# EAGLE schematic rollo_steuerung_MEGA8_CAN (EAGLE 5.06)
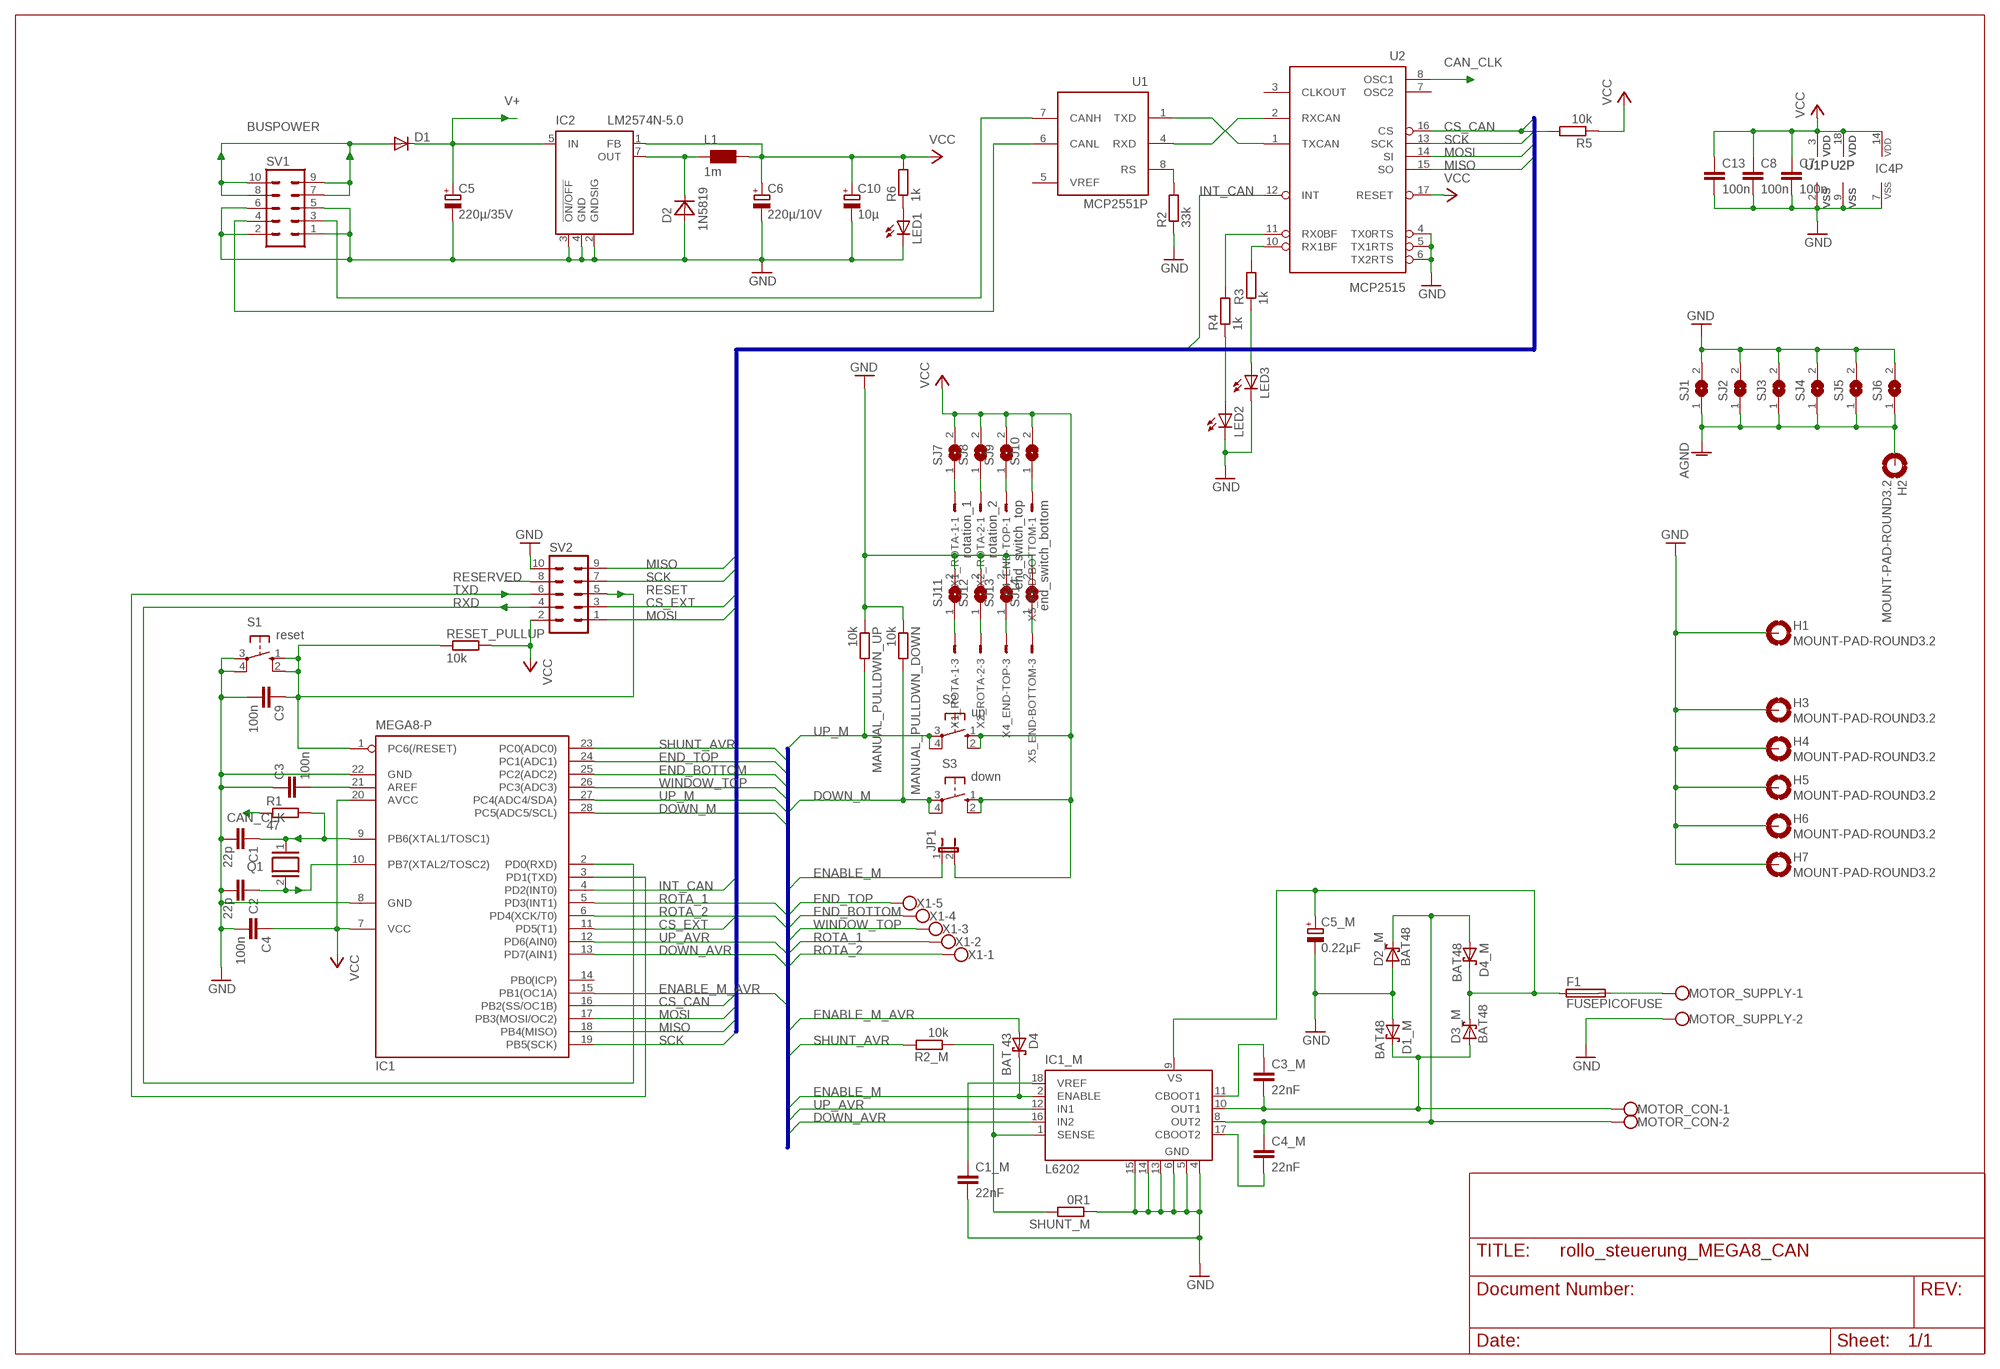
[diagram p0: schematic, sheet 1]

## Parts
C1  22p  C-EU025-024X044  [C025-024X044]
C1_M  22nF  C-EU025-024X044  [C025-024X044]
C2  22p  C-EU025-024X044  [C025-024X044]
C3  100n  C-EU025-024X044  [C025-024X044]
C3_M  22nF  C-EU025-024X044  [C025-024X044]
C4  100n  C-EU025-024X044  [C025-024X044]
C4_M  22nF  C-EU025-024X044  [C025-024X044]
C5  220µ/35V  CPOL-EUE3.5-8  [E3,5-8]
C5_M  0.22µF  CPOL-EUE2.5-5  [E2,5-5]
C6  220µ/10V  CPOL-EUE3.5-8  [E3,5-8]
C7  100n  C-EU025-024X044  [C025-024X044]
C8  100n  C-EU025-024X044  [C025-024X044]
C9  100n  C-EU025-024X044  [C025-024X044]
C10  10µ  CPOL-EUE2.5-5  [E2,5-5]
C13  100n  C-EU025-024X044  [C025-024X044]
D1  DIODE-MELF-MLL41  [MELF-MLL41]
D1_M  BAT48  BAT42  [DO35-10]
D2  1N5819  DIODE  [DO41-7]
D2_M  BAT48  BAT42  [DO35-10]
D3_M  BAT48  BAT42  [DO35-10]
D4  BAT 43  BAT42  [DO35-10]
D4_M  BAT48  BAT42  [DO35-10]
F1  FUSEPICOFUSE  [PICOFUSE]
H1  MOUNT-PAD-ROUND3.2  [3,2-PAD]
H2  MOUNT-PAD-ROUND3.2  [3,2-PAD]
H3  MOUNT-PAD-ROUND3.2  [3,2-PAD]
H4  MOUNT-PAD-ROUND3.2  [3,2-PAD]
H5  MOUNT-PAD-ROUND3.2  [3,2-PAD]
H6  MOUNT-PAD-ROUND3.2  [3,2-PAD]
H7  MOUNT-PAD-ROUND3.2  [3,2-PAD]
IC1  MEGA8-P  [DIL28-3]
IC1_M  L6202  [DIL18]
IC2  LM2574N-5.0  LM2574N-3.3  [DIL08]
IC4  4093N  [DIL14]
JP1  JP1E  [JP1]
L1  1m  L  [FASTRON-09P]
LED1  LED3MM  [LED3MM]
LED2  LED3MM  [LED3MM]
LED3  LED3MM  [LED3MM]
MANUAL_PULLDWN_DOWN  10k  R-EU_0204/7  [0204/7]
MANUAL_PULLDWN_UP  10k  R-EU_0204/7  [0204/7]
MOTOR_CON  W237-102  [W237-102]
MOTOR_SUPPLY  W237-102  [W237-102]
Q1  XTAL/S  [QS]
R1  47  R-EU_0204/7  [0204/7]
R2  33k  R-EU_0204/7  [0204/7]
R2_M  10k  R-EU_0204/7  [0204/7]
R3  1k  R-EU_0204/7  [0204/7]
R4  1k  R-EU_0204/7  [0204/7]
R5  10k  R-EU_0204/7  [0204/7]
R6  1k  R-EU_0204/7  [0204/7]
RESET_PULLUP  10k  R-EU_0204/7  [0204/7]
S1  reset  10-XX  [B3F-10XX]
S2  up  10-XX  [B3F-10XX]
S3  down  10-XX  [B3F-10XX]
SHUNT_M  0R1  R-EU_0204/7  [0204/7]
SJ1  SJW  [SJW]
SJ2  SJW  [SJW]
SJ3  SJW  [SJW]
SJ4  SJW  [SJW]
SJ5  SJW  [SJW]
SJ6  SJW  [SJW]
SJ7  SJW  [SJW]
SJ8  SJW  [SJW]
SJ9  SJW  [SJW]
SJ10  SJW  [SJW]
SJ11  SJW  [SJW]
SJ12  SJW  [SJW]
SJ13  SJW  [SJW]
SJ14  SJW  [SJW]
SV1  ML10L  [ML10L]
SV2  ML10  [ML10]
U1  MCP2551P  [DIL8]
U2  MCP2515  MCP2510P  [DIL18]
X1  W237-05P  [W237-5P]
X1_ROTA-1  rotation_1  22-23-2031  [22-23-2031]
X2_ROTA-2  rotation_2  22-23-2031  [22-23-2031]
X4_END-TOP  end_switch_top  22-23-2031  [22-23-2031]
X5_END-BOTTOM  end_switch_bottom  22-23-2031  [22-23-2031]

## Nets
AGND: H2.B3,2(MOUNT) SJ1.1 SJ2.1 SJ3.1 SJ4.1 SJ5.1 SJ6.1
BUSPOWER: D1.A SV1.7 SV1.8 SV1.9 SV1.10
CAN_CLK: R1.1 U2.8(OSC1)
CANH: SV1.3 U1.7(CANH)
CANL: SV1.4 U1.6(CANL)
CS_CAN: IC1.16(PB2(SS/OC1B)) R5.2 U2.16(CS)
CS_EXT: IC1.11(PD5(T1)) SV2.3
DOWN_AVR: IC1.13(PD7(AIN1)) IC1_M.16(IN2)
DOWN_M: IC1.28(PC5(ADC5/SCL)) MANUAL_PULLDWN_DOWN.2 S3.3(P) S3.4(P1)
ENABLE_M: D4.C IC1_M.2(ENABLE) JP1.1
ENABLE_M_AVR: D4.A IC1.15(PB1(OC1A))
END_BOTTOM: IC1.25(PC2(ADC2)) X1.4
END_TOP: IC1.24(PC1(ADC1)) X1.5
GND: C1.2 C1_M.2 C2.2 C3.1 C4.2 C5.- C5_M.- C6.- C7.2 C8.2 C9.2 C10.- C13.2 D1_M.A D2.A D2_M.A H1.B3,2(MOUNT) H3.B3,2(MOUNT) H4.B3,2(MOUNT) H5.B3,2(MOUNT) H6.B3,2(MOUNT) H7.B3,2(MOUNT) IC1.8(GND) IC1.22(GND) IC1_M.4(GND) IC1_M.5(GND) IC1_M.6(GND) IC1_M.13(GND) IC1_M.14(GND) IC1_M.15(GND) IC2.2(GNDSIG) IC2.3(!ON/OFF) IC2.4(GND) IC4.7(P:VSS) LED1.K(C) LED2.K(C) LED3.K(C) MANUAL_PULLDWN_DOWN.1 MANUAL_PULLDWN_UP.1 MOTOR_SUPPLY.2 R2.1 S1.3(P) S1.4(P1) SHUNT_M.1 SJ1.2 SJ2.2 SJ3.2 SJ4.2 SJ5.2 SJ6.2 SJ11.2 SJ12.2 SJ13.2 SJ14.2 SV1.1 SV1.2 SV1.5 SV1.6 SV2.10 U1.2(VSS) U2.4(TX0RTS) U2.5(TX1RTS) U2.6(TX2RTS) U2.9(VSS)
INT_CAN: IC1.4(PD2(INT0)) U2.12(INT)
MISO: IC1.18(PB4(MISO)) SV2.9 U2.15(SO)
MOSI: IC1.17(PB3(MOSI/OC2)) SV2.1 U2.14(SI)
MOTOR_OUT1: C3_M.2 D1_M.C D3_M.A IC1_M.10(OUT1) MOTOR_CON.1
MOTOR_OUT2: C4_M.1 D2_M.C D4_M.A IC1_M.8(OUT2) MOTOR_CON.2
MOTOR_VSS: C5_M.+ D3_M.C D4_M.C F1.1 IC1_M.9(VS)
N$5: R2.2 U1.8(RS)
N$7: R3.2 U2.10(RX1BF)
N$8: SJ11.1 X1_ROTA-1.3
N$9: C4_M.2 IC1_M.17(CBOOT2)
N$10: SJ12.1 X2_ROTA-2.3
N$13: C3_M.1 IC1_M.11(CBOOT1)
N$15: D2.C IC2.7(OUT) L1.1
N$16: SJ13.1 X4_END-TOP.3
N$18: SJ14.1 X5_END-BOTTOM.3
N$19: C1_M.1 IC1_M.18(VREF)
N$22: SJ10.1 X5_END-BOTTOM.1
N$23: SJ9.1 X4_END-TOP.1
N$24: SJ8.1 X2_ROTA-2.1
N$25: SJ7.1 X1_ROTA-1.1
N$26: F1.2 MOTOR_SUPPLY.1
N$27: LED2.A R4.1
N$28: LED3.A R3.1
N$30: C3.2 IC1.21(AREF)
N$41: LED1.A R6.1
N$44: R4.2 U2.11(RX0BF)
RESERVED: SV2.8
RESET: C9.1 IC1.1(PC6(/RESET)) RESET_PULLUP.1 S1.1(S) S1.2(S1) SV2.5
ROTA_1: IC1.5(PD3(INT1)) X1.2
ROTA_2: IC1.6(PD4(XCK/T0)) X1.1
RXCAN: U1.4(RXD) U2.2(RXCAN)
RXD: IC1.2(PD0(RXD)) SV2.4
SCK: IC1.19(PB5(SCK)) SV2.7 U2.13(SCK)
SHUNT: IC1_M.1(SENSE) R2_M.1 SHUNT_M.2
SHUNT_AVR: IC1.23(PC0(ADC0)) R2_M.2
TXCAN: U1.1(TXD) U2.1(TXCAN)
TXD: IC1.3(PD1(TXD)) SV2.6
UP_AVR: IC1.12(PD6(AIN0)) IC1_M.12(IN1)
UP_M: IC1.27(PC4(ADC4/SDA)) MANUAL_PULLDWN_UP.2 S2.3(P) S2.4(P1)
V+: C5.+ D1.C IC2.5(IN)
VCC: C4.1 C6.+ C7.1 C8.1 C10.+ C13.1 IC1.7(VCC) IC1.20(AVCC) IC2.1(FB) IC4.14(P:VDD) JP1.2 L1.2 R5.1 R6.2 RESET_PULLUP.2 S2.1(S) S2.2(S1) S3.1(S) S3.2(S1) SJ7.2 SJ8.2 SJ9.2 SJ10.2 SV2.2 U1.3(VDD) U2.17(RESET) U2.18(VDD)
WINDOW_TOP: IC1.26(PC3(ADC3)) X1.3
XTAL1: C1.1 IC1.9(PB6(XTAL1/TOSC1)) Q1.1 R1.2
XTAL2: C2.1 IC1.10(PB7(XTAL2/TOSC2)) Q1.2
Unconnected: IC1.14(PB0(ICP)) IC4.1(A:I0) IC4.2(A:I1) IC4.3(A:O) IC4.4(B:O) IC4.5(B:I0) IC4.6(B:I1) IC4.8(C:I0) IC4.9(C:I1) IC4.10(C:O) IC4.11(D:O) IC4.12(D:I0) IC4.13(D:I1) U2.3(CLKOUT) U2.7(OSC2) X1_ROTA-1.2 X2_ROTA-2.2 X4_END-TOP.2 X5_END-BOTTOM.2

## Buses
MOSI,MISO,SCK,CS_CAN,CS_RFM12,INT_CAN,INT_RFM12,CS_EXT
IO_FOO,DOWN_M,DOWN_AVR,UP_M,UP_AVR,SHUNT_AVR,ENABLE_M,ENABLE_M_AVR,ROTA_1,ROTA_2,END_TOP,END_BOTTOM,WINDOW_TOP

## Power pins joined to a net without a drawn wire
VREF: U1.5(VREF)

## Library data of the parts
C1 C1_M C2 C3 C3_M C4 C4_M C7-C9 C13 = rcl:C-EU: CAPACITOR, European symbol
C5 C5_M C6 C10 = rcl:CPOL-EU: POLARIZED CAPACITOR, European symbol
D1 = diode:DIODE-: DIODE
D1_M D2_M D3_M D4 D4_M = diode:BAT42: DIODE barrier diode
D2 = lab_node:DIODE
F1 = fuse:FUSE: Fuse
H1-H7 = holes:MOUNT-PAD-ROUND: MOUNTING PAD, round
IC1 = atmel:MEGA8-P: MICROCONTROLLER 8 Kbytes FLASH, 1 kbytes SRAM, 512 bytes EEPROM, USART, 4-channel 10 bit ADC, 2-channel 8 bit ADC Pin compatible with Atmega48, ATMega88, ATMega168 Source: avr.lbr
IC1_M = st-microelectronics:L620: DMOS FULL BRIDGE DRIVER
IC2 = linear:LM2574?-*: SIMPLE SWITCHER 0.5A Step-Down Voltage Regulator Source: http://cache.national.com/ds/LM/LM2574.pdf
IC4 = 40xx:4093: Quad 2-input NAND schmitt trigger
JP1 = jumper:JP1E: JUMPER
L1 = lab_node:L
LED1-LED3 = led:LED: LED OSRAM: - CHIPLED LG R971, LG N971, LY N971, LG Q971, LY Q971, LO R971, LY R971 LH N974, LH R974 LS Q976, LO Q976, LY Q976 LO Q996 - Hyper CHIPLED LW Q18S LB Q993, LB Q99A, LB R99A - SideLED LS A670, LO A670, LY A670, LG A670, LP A670 LB A673, LV A673, LT A673, LW A673 LH A674 LY A675 LS A676, LA A676, LO A676, LY A676, LW A676 LS A679, LY A679, LG A679 - Hyper Micro SIDELED® LS Y876, LA Y876, LO Y876, LY Y876 LT Y87S - SmartLED LW L88C, LW L88S LB L89C, LB L89S, LG L890 LS L89K, LO L89K, LY L89K LS L896, LA L896, LO L896, LY L896 - TOPLED LS T670, LO T670, LY T670, LG T670, LP T670 LSG T670, LSP T670, LSY T670, LOP T670, LYG T670 LG T671, LOG T671, LSG T671 LB T673, LV T673, LT T673, LW T673 LH T674 LS T676, LA T676, LO T676, LY T676, LB T676, LH T676, LSB T676, LW T676 LB T67C, LV T67C, LT T67C, LS T67K, LO T67K, LY T67K, LW E67C LS E67B, LA E67B, LO E67B, LY E67B, LB E67C, LV E67C, LT E67C LW T67C LS T679, LY T679, LG T679 LS T770, LO T770, LY T770, LG T770, LP T770 LB T773, LV T773, LT T773, LW T773 LH T774 LS E675, LA E675, LY E675, LS T675 LS T776, LA T776, LO T776, LY T776, LB T776 LHGB T686 LT T68C, LB T68C - Hyper Mini TOPLED® LB M676 - Mini TOPLED Santana® LG M470 LS M47K, LO M47K, LY M47K Source: http://www.osram.convergy.de LUXEON: - LUMILED® LXK2-PW12-R00, LXK2-PW12-S00, LXK2-PW14-U00, LXK2-PW14-V00 LXK2-PM12-R00, LXK2-PM12-S00, LXK2-PM14-U00 LXK2-PE12-Q00, LXK2-PE12-R00, LXK2-PE12-S00, LXK2-PE14-T00, LXK2-PE14-U00 LXK2-PB12-K00, LXK2-PB12-L00, LXK2-PB12-M00, LXK2-PB14-N00, LXK2-PB14-P00, LXK2-PB14-Q00 LXK2-PR12-L00, LXK2-PR12-M00, LXK2-PR14-Q00, LXK2-PR14-R00 LXK2-PD12-Q00, LXK2-PD12-R00, LXK2-PD12-S00 LXK2-PH12-R00, LXK2-PH12-S00 LXK2-PL12-P00, LXK2-PL12-Q00, LXK2-PL12-R00 Source: www.luxeon.com KINGBRIGHT: KA-3528ASYC Source: www.kingbright.com
MANUAL_PULLDWN_DOWN MANUAL_PULLDWN_UP R1 R2 R2_M R3-R6 RESET_PULLUP SHUNT_M = resistor:R-EU_: RESISTOR, European symbol
MOTOR_CON MOTOR_SUPPLY = con-wago-500:W237-102: WAGO SCREW CLAMP
Q1 = special:XTAL/S: CRYSTAL
S1-S3 = switch-omron:10-XX: OMRON SWITCH
SJ1-SJ14 = jumper:SJ: SMD solder JUMPER
SV1 SV2 = lab_node:ML10: HARTING
U1 = microchip_can:MCP2551: High Speed CAN tranceiver
U2 = microchip_can:MCP2510
X1 = con-wago-508:W237-05P: WAGO SREW CLAMP
X1_ROTA-1 X2_ROTA-2 X4_END-TOP X5_END-BOTTOM = con-molex:22-23-2031: .100" (2.54mm) Center Header - 3 Pin